# EAGLE schematic 4-PT100 (EAGLE 7.7.0)
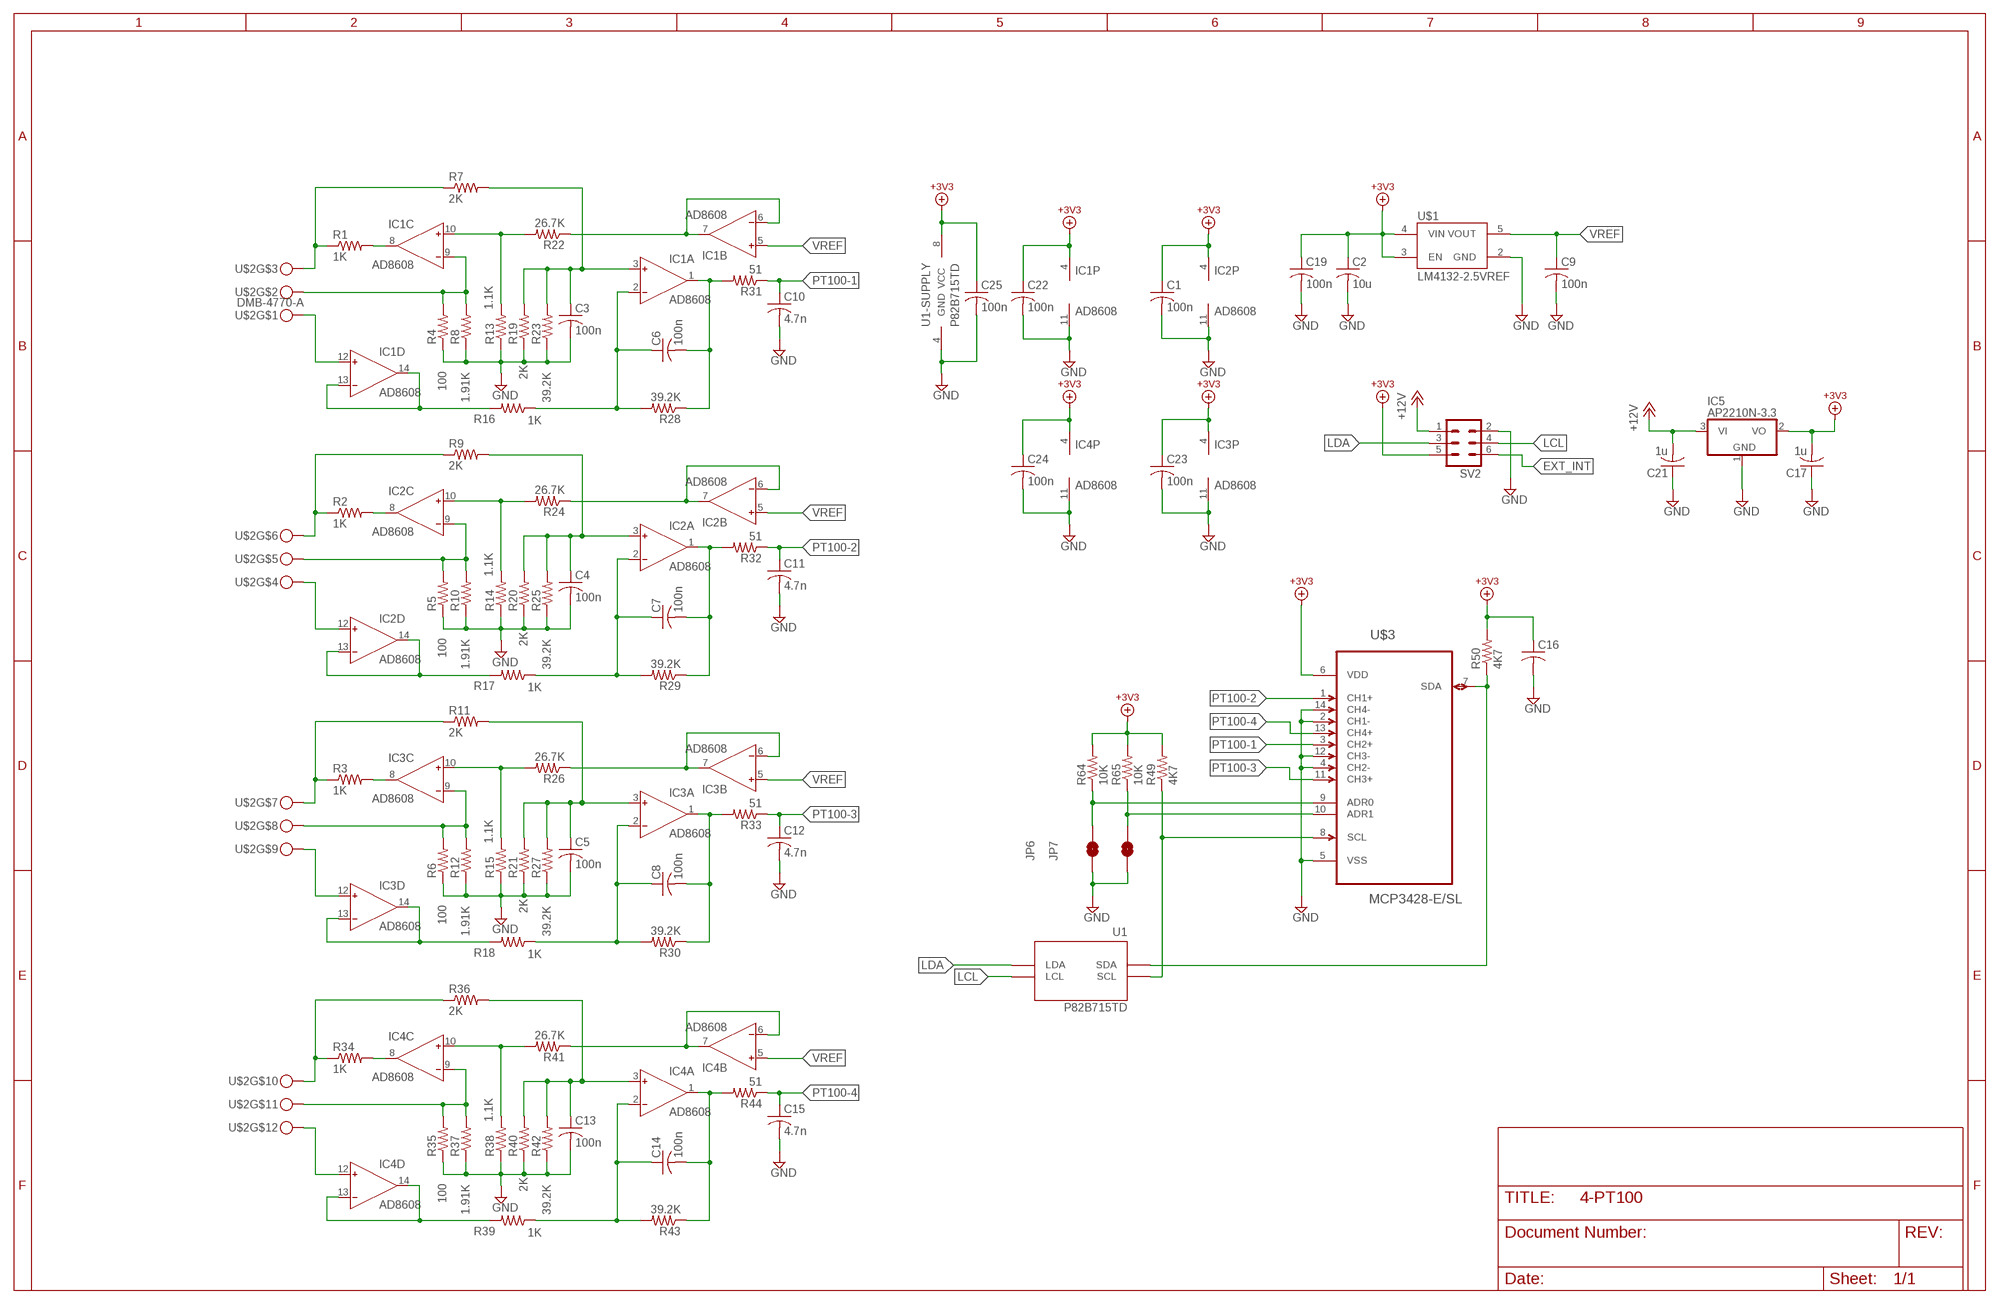
[diagram p0: schematic, sheet 1]

## Parts
C1  100n  C-USC0805  [C0805]
C2  10u  C-USC0805  [C0805]
C3  100n  C-USC0805  [C0805]
C4  100n  C-USC0805  [C0805]
C5  100n  C-USC0805  [C0805]
C6  100n  C-USC0805  [C0805]
C7  100n  C-USC0805  [C0805]
C8  100n  C-USC0805  [C0805]
C9  100n  C-USC0805  [C0805]
C10  4.7n  C-USC0805  [C0805]
C11  4.7n  C-USC0805  [C0805]
C12  4.7n  C-USC0805  [C0805]
C13  100n  C-USC0805  [C0805]
C14  100n  C-USC0805  [C0805]
C15  4.7n  C-USC0805  [C0805]
C16  C-USC0805  [C0805]
C17  1u  C-USC0805  [C0805]
C19  100n  C-USC0805  [C0805]
C21  1u  C-USC0805  [C0805]
C22  100n  C-USC0805  [C0805]
C23  100n  C-USC0805  [C0805]
C24  100n  C-USC0805  [C0805]
C25  100n  C-USC0805  [C0805]
IC1  AD8608  AD8609R  [SO14]
IC2  AD8608  AD8609R  [SO14]
IC3  AD8608  AD8609R  [SO14]
IC4  AD8608  AD8609R  [SO14]
IC5  AP2210N-3.3  MCP1703CB  [SOT23]
JP6  JUMPER-PAD-2-NOYES_SILK  [PAD-JUMPER-2-NO_YES_SILK]
JP7  JUMPER-PAD-2-NOYES_SILK  [PAD-JUMPER-2-NO_YES_SILK]
R1  1K  R-US_R0805  [R0805]
R2  1K  R-US_R0805  [R0805]
R3  1K  R-US_R0805  [R0805]
R4  100  R-US_R0805  [R0805]
R5  100  R-US_R0805  [R0805]
R6  100  R-US_R0805  [R0805]
R7  2K  R-US_R0805  [R0805]
R8  1.91K  R-US_R0805  [R0805]
R9  2K  R-US_R0805  [R0805]
R10  1.91K  R-US_R0805  [R0805]
R11  2K  R-US_R0805  [R0805]
R12  1.91K  R-US_R0805  [R0805]
R13  1.1K  R-US_R0805  [R0805]
R14  1.1K  R-US_R0805  [R0805]
R15  1.1K  R-US_R0805  [R0805]
R16  1K  R-US_R0805  [R0805]
R17  1K  R-US_R0805  [R0805]
R18  1K  R-US_R0805  [R0805]
R19  2K  R-US_R0805  [R0805]
R20  2K  R-US_R0805  [R0805]
R21  2K  R-US_R0805  [R0805]
R22  26.7K  R-US_R0805  [R0805]
R23  39.2K  R-US_R0805  [R0805]
R24  26.7K  R-US_R0805  [R0805]
R25  39.2K  R-US_R0805  [R0805]
R26  26.7K  R-US_R0805  [R0805]
R27  39.2K  R-US_R0805  [R0805]
R28  39.2K  R-US_R0805  [R0805]
R29  39.2K  R-US_R0805  [R0805]
R30  39.2K  R-US_R0805  [R0805]
R31  51  R-US_R0805  [R0805]
R32  51  R-US_R0805  [R0805]
R33  51  R-US_R0805  [R0805]
R34  1K  R-US_R0805  [R0805]
R35  100  R-US_R0805  [R0805]
R36  2K  R-US_R0805  [R0805]
R37  1.91K  R-US_R0805  [R0805]
R38  1.1K  R-US_R0805  [R0805]
R39  1K  R-US_R0805  [R0805]
R40  2K  R-US_R0805  [R0805]
R41  26.7K  R-US_R0805  [R0805]
R42  39.2K  R-US_R0805  [R0805]
R43  39.2K  R-US_R0805  [R0805]
R44  51  R-US_R0805  [R0805]
R49  4K7  R-US_R0805  [R0805]
R50  4K7  R-US_R0805  [R0805]
R64  10K  R-US_R0805  [R0805]
R65  10K  R-US_R0805  [R0805]
SV2  ML6  [ML6]
U1  P82B715TD  [SOIC-8]
U$1  LM4132-2.5VREF  LM4128-2.5VREF  [SOT23-5]
U$2  DMB-4770-A  [DMB-4770-A-PKG]
U$3  MCP3428-E/SL  [SOIC127P600X175-14N]

## Nets
+3V3: C1.1 C2.1 C16.1 C17.2 C19.1 C22.1 C23.1 C24.1 C25.1 IC1.4(P:V+) IC2.4(P:V+) IC3.4(P:V+) IC4.4(P:V+) IC5.2(VO) R49.2 R50.2 R64.2 R65.2 SV2.5 U1.8(VCC) U$1.3(EN) U$1.4(VIN) U$3.6(VDD) ; supply symbol labelled V+3V3
+12VBUS: C21.2 IC5.3(VI) SV2.1 ; supply symbol labelled +12V
EXT_INT: SV2.6
GND: C1.2 C2.2 C3.2 C4.2 C5.2 C9.2 C10.2 C11.2 C12.2 C13.2 C15.2 C16.2 C17.1 C19.2 C21.1 C22.2 C23.2 C24.2 C25.2 IC1.11(P:V-) IC2.11(P:V-) IC3.11(P:V-) IC4.11(P:V-) IC5.1(GND) JP6.1 JP7.1 R4.1 R5.1 R6.1 R8.1 R10.1 R12.1 R13.1 R14.1 R15.1 R19.1 R20.1 R21.1 R23.1 R25.1 R27.1 R35.1 R37.1 R38.1 R40.1 R42.1 SV2.2 U1.4(GND) U$1.2(GND) U$3.2(CH1-) U$3.4(CH2-) U$3.5(VSS) U$3.12(CH3-) U$3.14(CH4-)
LCL: SV2.4 U1.2(LCL)
LDA: SV2.3 U1.7(LDA)
N$1: IC2.12(D:IN+) U$2.P$4
N$2: IC2.13(D:IN-) IC2.14(D:OUT) R17.2
N$3: IC2.9(C:IN-) R5.2 R10.2 U$2.P$5
N$4: R2.1 R9.1 U$2.P$6
N$5: IC2.8(C:OUT) R2.2
N$6: IC3.12(D:IN+) U$2.P$9
N$7: IC3.13(D:IN-) IC3.14(D:OUT) R18.2
N$8: IC2.10(C:IN+) R14.2 R24.2
N$9: C4.1 IC2.3(A:IN+) R9.2 R20.2 R25.2
N$10: IC2.6(B:IN-) IC2.7(B:OUT) R24.1
N$11: IC3.9(C:IN-) R6.2 R12.2 U$2.P$8
N$12: R3.1 R11.1 U$2.P$7
N$13: C7.1 IC2.2(A:IN-) R17.1 R29.2
N$14: C7.2 IC2.1(A:OUT) R29.1 R32.2
N$15: IC3.8(C:OUT) R3.2
N$16: IC3.10(C:IN+) R15.2 R26.2
N$17: C5.1 IC3.3(A:IN+) R11.2 R21.2 R27.2
N$18: IC3.6(B:IN-) IC3.7(B:OUT) R26.1
N$19: C8.1 IC3.2(A:IN-) R18.1 R30.2
N$20: C8.2 IC3.1(A:OUT) R30.1 R33.2
N$21: IC4.12(D:IN+) U$2.P$12
N$22: IC4.13(D:IN-) IC4.14(D:OUT) R39.2
N$23: IC4.9(C:IN-) R35.2 R37.2 U$2.P$11
N$24: R34.1 R36.1 U$2.P$10
N$25: IC4.8(C:OUT) R34.2
N$26: IC4.10(C:IN+) R38.2 R41.2
N$27: C13.1 IC4.3(A:IN+) R36.2 R40.2 R42.2
N$28: IC4.6(B:IN-) IC4.7(B:OUT) R41.1
N$29: C14.1 IC4.2(A:IN-) R39.1 R43.2
N$30: C14.2 IC4.1(A:OUT) R43.1 R44.2
N$31: IC1.12(D:IN+) U$2.P$1
N$32: IC1.13(D:IN-) IC1.14(D:OUT) R16.2
N$33: IC1.9(C:IN-) R4.2 R8.2 U$2.P$2
N$34: R1.1 R7.1 U$2.P$3
N$35: IC1.8(C:OUT) R1.2
N$36: IC1.10(C:IN+) R13.2 R22.2
N$37: C3.1 IC1.3(A:IN+) R7.2 R19.2 R23.2
N$38: IC1.6(B:IN-) IC1.7(B:OUT) R22.1
N$39: C6.1 IC1.2(A:IN-) R16.1 R28.2
N$40: C6.2 IC1.1(A:OUT) R28.1 R31.2
N$41: R49.1 U1.3(SCL) U$3.8(SCL)
N$42: R50.1 U1.6(SDA) U$3.7(SDA)
N$132: JP7.2 R65.1 U$3.10(ADR1)
N$133: JP6.2 R64.1 U$3.9(ADR0)
PT100-1: C10.1 R31.1 U$3.3(CH2+)
PT100-2: C11.1 R32.1 U$3.1(CH1+)
PT100-3: C12.1 R33.1 U$3.11(CH3+)
PT100-4: C15.1 R44.1 U$3.13(CH4+)
VREF: C9.1 IC1.5(B:IN+) IC2.5(B:IN+) IC3.5(B:IN+) IC4.5(B:IN+) U$1.5(VOUT)

## Library data of the parts
C1-C17 C19 C21-C25 = resistor:C-US: CAPACITOR, American symbol
IC1-IC4 = analog-devices:AD8609: Precision Micropower, Low Noise CMOS, Rail-to-Rail Input/Output Operational Amplifiers Source: http://www.analog.com/static/imported-files/data_sheets/AD8603_8607_8609.pdf; MPN: AD8609ARZ; OC_FARNELL: 1581951; OC_NEWARK: 19M0976
IC5 = linear:MCP1703: 250 mA, 16V, Low Quiescent Current LDO Regulator Source: http://ww1.microchip.com/downloads/en/DeviceDoc/22049b.pdf
JP6 JP7 = SparkFun-Passives:JUMPER-PAD-2-NO
R1-R44 R49 R50 R64 R65 = resistor:R-US_: RESISTOR, American symbol
SV2 = con-harting-ml:ML6: HARTING; OC_FARNELL: unknown; OC_NEWARK: unknown
U1 = Volks73-NXPSemiconductors:P82B715?: I2C-Bus Extender I2C-bus extender Documentation Datasheet <http://www.nxp.com/documents/data_sheet/P82B715.pdf> General Description The P82B715 is a bipolar IC intended for application in I2C-bus and derivative bus systems. While retaining all the operating modes and features of the I2C-bus it permits extension of the practical separation distance between components on the I2C-bus by buffering both the data (SDA) and the clock (SCL) lines. The I2C-bus capacitance limit of 400 pF restricts practical communication distances to a few meters. Using one P82B715 at each end of a long cable (connecting Lx/Ly to Lx/Ly) reduces that cable’s loading on the linked I2C-buses by a factor of 10 and allows the total system capacitance load (all devices, cable, connectors, and traces or wires connected to the I2C-bus) to be around 3000 pF while the loading on each I2C-bus on the Sx/Sy sides remains below 400 pF. Longer cables or low-cost, general-purpose wiring may be used to link I2C-bus based modules without degrading noise margins. Multiple P82B715s can be connected together, linking their Lx/Ly ports, in a star or multi-point architecture as long as the total capacitance of the system is less than about 3000 pF and each bus at an Sx/Sy connection is well below 400 pF. This configuration, with the master and/or slave devices attached to the Sx/Sy port of each P82B715, has full multi-master communication capability. The P82B715 alone does not support voltage level translation, but it can be simply implemented using low cost transistors when required. There is no restriction on interconnecting the Sx/Sy I/Os, and, because the device output levels are always held within 100 mV of input drive levels, P82B715 is compatible with bus buffers that use voltage level offsets, e.g., PCA9511A, PCA9517, Sx/Sy side of P82B96. The lower VOL level and ability to operate with any master, slave or bus buffer is the primary advantage of the using the P82B715 for long distance buses at the disadvantage of not isolating bus capacitance like the P82B96 or PCA9600 are able to do. The primary disadvantage of the P82B96 and PCA9600 is that the static level offset needed to isolate bus capacitance does not allow these devices to operate with other bus buffers with special offset levels or with master/slaves that require a VIL lower than 0.8 V with noise margin. A proven quick design-in point-to-point/multi-point circuit (Figure 9) is included in Section 8.2 to allow rapid use of the P82B715 along with comparison waveforms so that the designer can clearly see the trade-offs between the P82B715 and the P82B96/PCA9600 and choose the type of device that is best for their application. Features Dual, bidirectional, unity voltage gain buffer with no external directional control required Compatible with I2C-bus and its derivatives SMBus, PMBus, DDC, etc. Logic signal levels may include (but not exceed) both supply and ground Logic signal input voltage levels are output without change and are independent of VCC ×10 impedance transformation, but does not change logic voltage levels Supply voltage range 3 V to 12 V Clock speeds to at least 100 kHz and 400 kHz when other system delays permit ESD protection exceeds 2500 V HBM per Mil. Std 883C-3015.7 and 400 V MM per JESD22-A115 (I/Os have diodes to VCC and GND) Latch-up testing is done to JEDEC Standard JESD78 which exceeds 100 mA Applications Increase the total connected capacitance of an I2C-bus system to around 3000 pF Drive I2C-bus signals over long cables to approximately 50 meters or 3000 pF Drives ×10 lower impedance bus wiring for improved noise immunity Multi-drop distribution of I2C-bus signals using low cost twisted-pair cables AdvancedTCA radial IPMB architecture Driving 30 mA Fm+ devices from standard 3 mA parts; APPLICATIONS: I2C; CAPACITANCE-INPUT: 3000pF; CURRENT_SUPPLY: 22mA; DATA_RATE: 400kHz; DELAY_TIME: -; DESCRIPTION: IC REDRIVER I2C 1CH 400KHZ 8SO; DOCUMENTATION_LINK: <a href="http://www.nxp.com/documents/data_sheet/P82B715.pdf">Datasheet</a>; DOCUMENTATION_URL: http://www.nxp.com/documents/data_sheet/P82B715.pdf; INPUT: 2-Wire Buse; MANUFACTURER: NXP Semiconductors; NUMBER_OF_CHANNELS: 1; OPERATING_TEMPERATURE: -40C ~ 85C; OUTPUT: 2-Wire Bus; PART_NUMBER: P82B715TD,118; SIGNAL_CONDITIONING: -; SUPPLIER_ITEM_LINK: <a href="http://www.digikey.com/product-detail/en/P82B715TD,118/568-1007-2-ND/735621">Details</a>; SUPPLIER_ITEM_NUMBER: 568-1007-2-ND; SUPPLIER_ITEM_URL: http://www.digikey.com/product-detail/en/P82B715TD,118/568-1007-2-ND/735621; SUPPLIER_LINK: <a href="http://www.digikey.com">Home Page</a>; SUPPLIER_NAME: Digi-Key; SUPPLIER_URL: http://www.digikey.com; TYPE: Buffer, ReDriver; VOLTAGE_SUPPLY: 4.5V ~ 12V
U$1 = SparkFun-PowerIC:LM4128-2.5VREF: .1% accurate low-current voltage reference
U$2 = Cedric:DMB-4770-A
U$3 = Microchip_By_element14_Batch_1:MCP3428-E/SL: Analog-to-Digital Converter; MPN: MCP3428-E/SL; OC_FARNELL: 1825014; OC_NEWARK: 52R9962; PACKAGE: SOIC-14; SUPPLIER: Microchip